# EAGLE schematic LVDS-Banana (EAGLE 6.3)
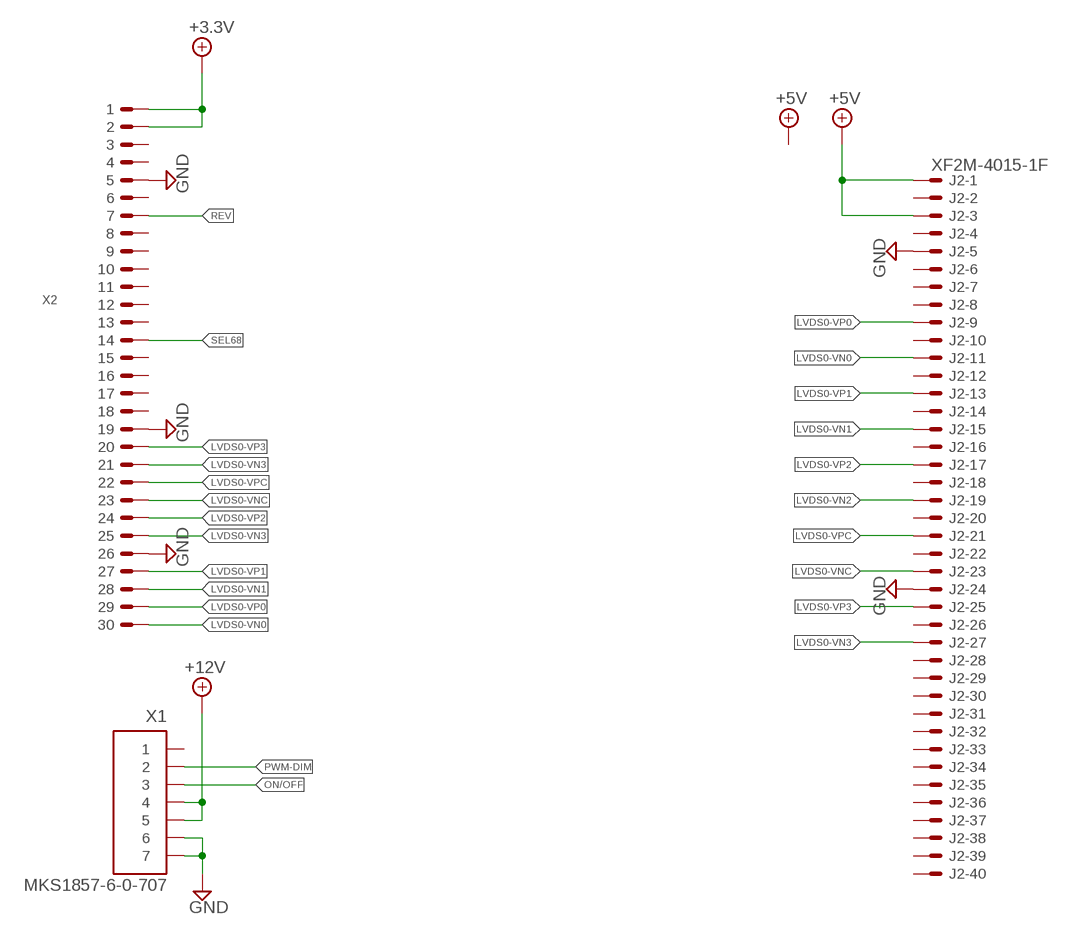
[diagram p0: schematic, sheet 1]

## Parts
J2  XF2M-4015-1F  [XF2M-4015-1F]
X1  MKS1857-6-0-707  [MKS1857-6-0-707]
X2  DF14-30P-1.25H  [DF14-30]

## Nets
+3.3V: X2.1 X2.2
+5V: J2.1 J2.3
+12V: X1.4 X1.5
GND: J2.5 J2.24 X1.6 X1.7 X2.5 X2.19 X2.26
LVDS0-VN0: J2.11 X2.30
LVDS0-VN1: J2.15 X2.28
LVDS0-VN2: J2.19
LVDS0-VN3: J2.27 X2.21 X2.25
LVDS0-VNC: J2.23 X2.23
LVDS0-VP0: J2.9 X2.29
LVDS0-VP1: J2.13 X2.27
LVDS0-VP2: J2.17 X2.24
LVDS0-VP3: J2.25 X2.20
LVDS0-VPC: J2.21 X2.22
ON/OFF: X1.3
PWM-DIM: X1.2
REV: X2.7
SEL68: X2.14
Unconnected: J2.2 J2.4 J2.6 J2.7 J2.8 J2.10 J2.12 J2.14 J2.16 J2.18 J2.20 J2.22 J2.26 J2.28 J2.29 J2.30 J2.31 J2.32 J2.33 J2.34 J2.35 J2.36 J2.37 J2.38 J2.39 J2.40 X1.1 X2.3 X2.4 X2.6 X2.8 X2.9 X2.10 X2.11 X2.12 X2.13 X2.15 X2.16 X2.17 X2.18

## Library data of the parts
J2 = adafruit:XF2*-40?: OMRON FPC Connector Source : http://www.omron.com/ecb/products/pdf/fpc.pdf XF2M-4015-rev is good for connecting up 'PSP' SHARP LQ043 LCDs
X1 = con-stocko:MKS1857-6-0-707: Serie MKS 1850 Lötstifte In-line, Raster 2.5 mm, Stiftwannen, stehend, mit Rastlasche Source: http://www.stocko.de/de/index.php?seite=ka_rfk2_mks1850.html&rubrik=Katalog+-+RFK+2 rfk_1850.pdf; OC_FARNELL: unknown; OC_NEWARK: unknown
X2 = muccc:DF14-30P-1.25H: DF14 Series 30 Pin 1.25 Pitch Connector for LCD LVDS